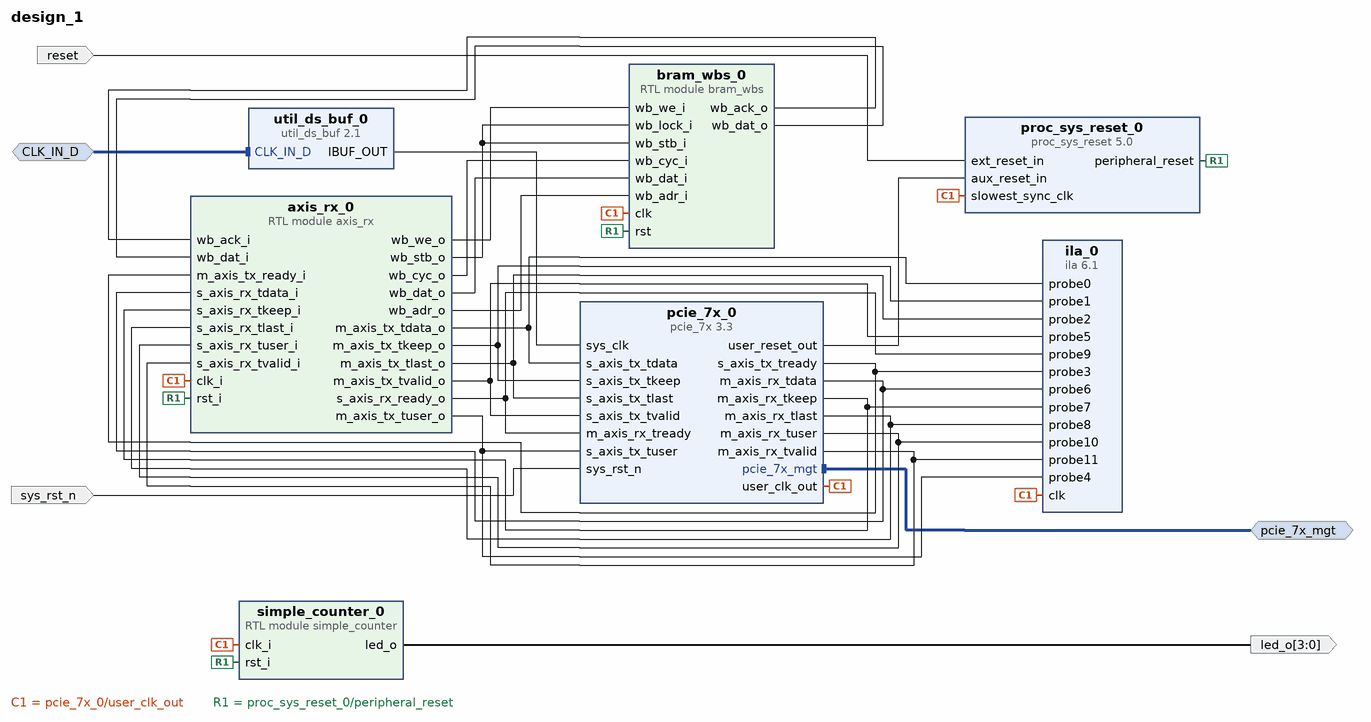
[diagram p0: block diagram of the top level]
# Vivado block design design_1, Vivado 2016.2
create_bd_design design_1

create_bd_intf_port -mode Master -vlnv xilinx.com:interface:pcie_7x_mgt_rtl:1.0 pcie_7x_mgt
create_bd_intf_port -mode Slave -vlnv xilinx.com:interface:diff_clock_rtl:1.0 CLK_IN_D
create_bd_port -dir I -type rst reset
set_property -dict {CONFIG.POLARITY ACTIVE_LOW} [get_bd_ports reset]
create_bd_port -dir O -from 3 -to 0 led_o
create_bd_port -dir I -type rst sys_rst_n

create_bd_cell -type ip -vlnv xilinx.com:ip:proc_sys_reset:5.0 proc_sys_reset_0
create_bd_cell -type ip -vlnv xilinx.com:ip:util_ds_buf:2.1 util_ds_buf_0
set_property -dict {CONFIG.C_BUF_TYPE IBUFDSGTE} [get_bd_cells util_ds_buf_0]
create_bd_cell -type ip -vlnv xilinx.com:ip:pcie_7x:3.3 pcie_7x_0
set_property -dict [list \
  CONFIG.mode_selection Advanced \
  CONFIG.Maximum_Link_Width X4 \
  CONFIG.Link_Speed 5.0_GT/s \
  CONFIG.Interface_Width 64_bit \
  CONFIG.User_Clk_Freq 250 \
  CONFIG.Bar0_64bit false \
  CONFIG.Bar0_Scale Bytes \
  CONFIG.Bar0_Size 256 \
  CONFIG.Bar1_Enabled true \
  CONFIG.Bar1_Type Memory \
  CONFIG.Bar1_Scale Kilobytes \
  CONFIG.Bar1_Size 4 \
  CONFIG.Bar2_Enabled true \
  CONFIG.Bar2_Type Memory \
  CONFIG.Bar2_64bit false \
  CONFIG.Bar2_Scale Kilobytes \
  CONFIG.Bar2_Size 32 \
  CONFIG.Bar3_Enabled true \
  CONFIG.Bar3_Type Memory \
  CONFIG.Bar3_Scale Kilobytes \
  CONFIG.Bar3_Size 2 \
  CONFIG.Bar4_Enabled true \
  CONFIG.Bar4_Type Memory \
  CONFIG.Bar4_Scale Kilobytes \
  CONFIG.Bar4_Size 2 \
  CONFIG.Bar5_Enabled false \
  CONFIG.Bar5_Type N/A \
  CONFIG.Bar5_Size 2 \
  CONFIG.Device_ID 7024 \
  CONFIG.Max_Payload_Size 512_bytes \
  CONFIG.Trgt_Link_Speed {4'h2} \
  CONFIG.Enable_Slot_Clock_Cfg true \
  CONFIG.MSIx_Table_BIR BAR_0 \
  CONFIG.MSIx_PBA_BIR BAR_0 \
  CONFIG.DSN_Enabled true \
  CONFIG.PCIe_Blk_Locn X0Y0 \
  CONFIG.Trans_Buf_Pipeline None \
  CONFIG.En_route_unlock false \
  CONFIG.PCIe_Debug_Ports false \
  CONFIG.Ref_Clk_Freq 100_MHz \
  CONFIG.RBAR_Num 0 \
  CONFIG.en_ext_clk false \
  CONFIG.pl_interface false \
  CONFIG.cfg_mgmt_if false \
  CONFIG.cfg_ctl_if false \
  CONFIG.cfg_status_if false \
  CONFIG.rcv_msg_if false \
  CONFIG.cfg_fc_if false \
  CONFIG.err_reporting_if false \
  CONFIG.pipe_mode_sim None \
] [get_bd_cells pcie_7x_0]
create_bd_cell -type module -reference simple_counter simple_counter_0
create_bd_cell -type module -reference bram_wbs bram_wbs_0
set_property -dict {CONFIG.ADDR_WIDTH 8} [get_bd_cells bram_wbs_0]
create_bd_cell -type module -reference axis_rx axis_rx_0
set_property -dict {CONFIG.wb_address_width_c 8 CONFIG.address_mask_c 0x000000FF} [get_bd_cells axis_rx_0]
create_bd_cell -type ip -vlnv xilinx.com:ip:ila:6.1 ila_0
set_property -dict [list \
  CONFIG.C_PROBE10_WIDTH 22 \
  CONFIG.C_PROBE7_WIDTH 8 \
  CONFIG.C_PROBE6_WIDTH 64 \
  CONFIG.C_PROBE4_WIDTH 4 \
  CONFIG.C_PROBE1_WIDTH 8 \
  CONFIG.C_PROBE0_WIDTH 64 \
  CONFIG.C_NUM_OF_PROBES 12 \
  CONFIG.C_ENABLE_ILA_AXI_MON false \
  CONFIG.C_MONITOR_TYPE Native \
] [get_bd_cells ila_0]

# ---- connections ----

connect_bd_intf_net [get_bd_intf_ports pcie_7x_mgt] [get_bd_intf_pins pcie_7x_0/pcie_7x_mgt]
connect_bd_intf_net [get_bd_intf_ports CLK_IN_D] [get_bd_intf_pins util_ds_buf_0/CLK_IN_D]
connect_bd_net -net clk_wiz_clk_out1 [get_bd_pins pcie_7x_0/user_clk_out] \
  [get_bd_pins proc_sys_reset_0/slowest_sync_clk] [get_bd_pins simple_counter_0/clk_i] [get_bd_pins bram_wbs_0/clk] \
  [get_bd_pins axis_rx_0/clk_i] [get_bd_pins ila_0/clk]
connect_bd_net [get_bd_ports reset] [get_bd_pins proc_sys_reset_0/ext_reset_in]
connect_bd_net [get_bd_pins util_ds_buf_0/IBUF_OUT] [get_bd_pins pcie_7x_0/sys_clk]
connect_bd_net [get_bd_pins pcie_7x_0/user_reset_out] [get_bd_pins proc_sys_reset_0/aux_reset_in]
connect_bd_net [get_bd_pins simple_counter_0/led_o] [get_bd_ports led_o]
connect_bd_net [get_bd_ports sys_rst_n] [get_bd_pins pcie_7x_0/sys_rst_n]
connect_bd_net [get_bd_pins proc_sys_reset_0/peripheral_reset] \
  [get_bd_pins simple_counter_0/rst_i] [get_bd_pins bram_wbs_0/rst] [get_bd_pins axis_rx_0/rst_i]
connect_bd_net [get_bd_pins axis_rx_0/m_axis_tx_tdata_o] [get_bd_pins pcie_7x_0/s_axis_tx_tdata] [get_bd_pins ila_0/probe0]
connect_bd_net [get_bd_pins axis_rx_0/m_axis_tx_tkeep_o] [get_bd_pins pcie_7x_0/s_axis_tx_tkeep] [get_bd_pins ila_0/probe1]
connect_bd_net [get_bd_pins axis_rx_0/m_axis_tx_tlast_o] [get_bd_pins pcie_7x_0/s_axis_tx_tlast] [get_bd_pins ila_0/probe2]
connect_bd_net [get_bd_pins axis_rx_0/m_axis_tx_tvalid_o] [get_bd_pins pcie_7x_0/s_axis_tx_tvalid] [get_bd_pins ila_0/probe5]
connect_bd_net [get_bd_pins pcie_7x_0/s_axis_tx_tready] [get_bd_pins axis_rx_0/m_axis_tx_ready_i] [get_bd_pins ila_0/probe3]
connect_bd_net [get_bd_pins pcie_7x_0/m_axis_rx_tdata] [get_bd_pins axis_rx_0/s_axis_rx_tdata_i] [get_bd_pins ila_0/probe6]
connect_bd_net [get_bd_pins pcie_7x_0/m_axis_rx_tkeep] [get_bd_pins axis_rx_0/s_axis_rx_tkeep_i] [get_bd_pins ila_0/probe7]
connect_bd_net [get_bd_pins pcie_7x_0/m_axis_rx_tlast] [get_bd_pins axis_rx_0/s_axis_rx_tlast_i] [get_bd_pins ila_0/probe8]
connect_bd_net [get_bd_pins axis_rx_0/s_axis_rx_ready_o] [get_bd_pins pcie_7x_0/m_axis_rx_tready] [get_bd_pins ila_0/probe9]
connect_bd_net [get_bd_pins pcie_7x_0/m_axis_rx_tuser] [get_bd_pins axis_rx_0/s_axis_rx_tuser_i] [get_bd_pins ila_0/probe10]
connect_bd_net [get_bd_pins pcie_7x_0/m_axis_rx_tvalid] [get_bd_pins axis_rx_0/s_axis_rx_tvalid_i] [get_bd_pins ila_0/probe11]
connect_bd_net [get_bd_pins bram_wbs_0/wb_ack_o] [get_bd_pins axis_rx_0/wb_ack_i]
connect_bd_net [get_bd_pins bram_wbs_0/wb_dat_o] [get_bd_pins axis_rx_0/wb_dat_i]
connect_bd_net [get_bd_pins axis_rx_0/wb_we_o] [get_bd_pins bram_wbs_0/wb_we_i]
connect_bd_net [get_bd_pins axis_rx_0/wb_stb_o] [get_bd_pins bram_wbs_0/wb_stb_i] [get_bd_pins bram_wbs_0/wb_lock_i]
connect_bd_net [get_bd_pins axis_rx_0/wb_cyc_o] [get_bd_pins bram_wbs_0/wb_cyc_i]
connect_bd_net [get_bd_pins axis_rx_0/wb_dat_o] [get_bd_pins bram_wbs_0/wb_dat_i]
connect_bd_net [get_bd_pins axis_rx_0/wb_adr_o] [get_bd_pins bram_wbs_0/wb_adr_i]
connect_bd_net [get_bd_pins axis_rx_0/m_axis_tx_tuser_o] [get_bd_pins pcie_7x_0/s_axis_tx_tuser] [get_bd_pins ila_0/probe4]

validate_bd_design
save_bd_design
